# Altium schematic sheet sh1.SchDoc
size A4
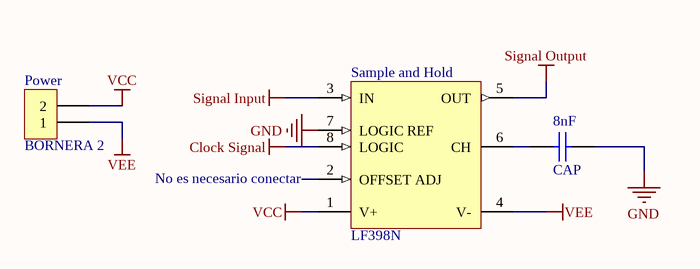
[diagram p0: sh1.SchDoc]

## Parts
8nF  CAP  [CAP200]
Power  BORNERA 2  [BORNERA2]
Sample_and_Hold  LF398N  [N08E]

## Nets
Clock Signal: Sample_and_Hold.8(LOGIC)
GND: 8nF.2 Sample_and_Hold.7(LOGIC_REF)
Signal Input: Sample_and_Hold.3(IN)
Signal Output: Sample_and_Hold.5(OUT)
VCC: Power.2 Sample_and_Hold.1(V+)
VEE: Power.1 Sample_and_Hold.4(V-)
Net8nF_1: 8nF.1 Sample_and_Hold.6(CH)

Not connected (* = marked no-connect by the designer): Sample_and_Hold 2(OFFSET_ADJ)

## Notes on the sheet
- (near Sample_and_Hold) No es necesario conectar

## Library data of the parts
Sample_and_Hold = LF398N: Monolithic Sample and Hold Circuits, 8-pin MDIP; Manufacturer: National Semiconductor; PackageTopMarking: NSUZXYTTE#*LF*398N; PowerWise: N; CompType: Analog IC; PinCount: 8; DatasheetVersion: Jul-2000; Code_JEDEC: MS-001-BA; PackageVersion: revG, May-2006; PackageReference: N08E; PackageDescription: MDIP, .365 x .250 x .130in, 8 Lead, .100in Pitch; RoHS: N; PartNumber: LF398N